# EAGLE design tritiled22_cr2354 (EAGLE 8.2.2)
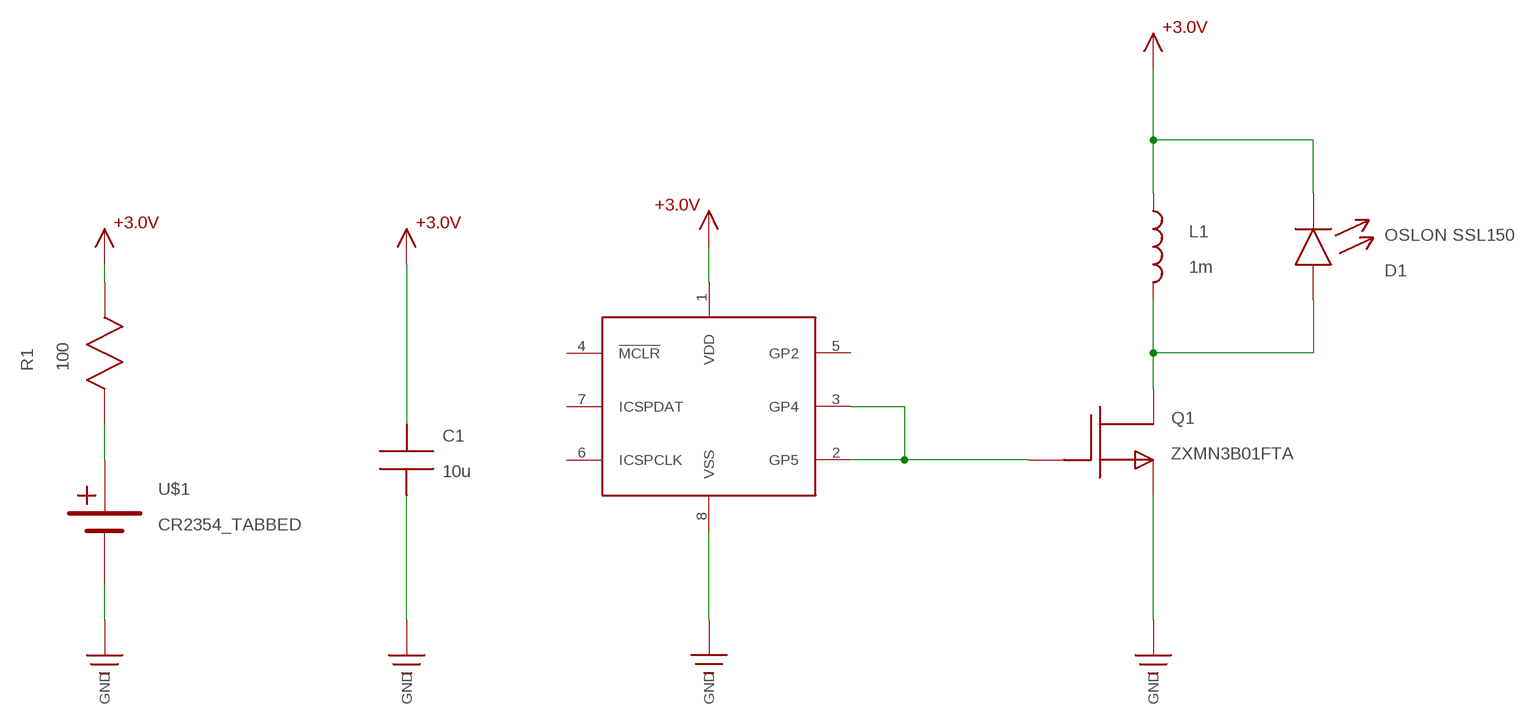
[diagram p0: schematic, sheet 1]

## Parts
C1  10u  C1206  [1206]
D1  OSLON SSL150  LEDSSL150  [OSLON_3030_LED]
L1  1m  SRR6028_INDUCTOR  [SRR6028_INDUCTOR]
Q1  ZXMN3B01FTA  ZXMN3B01FSOT23  [SOT-23]
R1  100  R1206  [R1206]
U1  PIC12LF1571  [SOIC8]
U$1  CR2354_TABBED  [CR2354_TABBED]

## Nets
+3.3V: C1.P$1 D1.C L1.P$1 R1.P$2 U1.1(VDD) ; supply symbol labelled +3.0V
GND: C1.P$2 Q1.2(S) U1.8(VSS) U$1.GND(0V)
N$5: D1.A L1.P$2 Q1.3(D)
N$8: Q1.1(G) U1.2(GP5) U1.3(GP4)
VBATT: R1.P$1 U$1.+3V(+V)
Unconnected: U1.4(!MCLR!) U1.5(GP2) U1.6(ICSPCLK) U1.7(ICSPDAT)

## Library data of the parts
C1 = tritiled:C
D1 = tritiled:LED
L1 = tritiled:SRR6028_INDUCTOR
Q1 = tritiled:ZXMN3B01F
R1 = tritiled:R
U1 = tritiled:PIC12LF1571
U$1 = tritiled:CR2354_TABBED

## Board
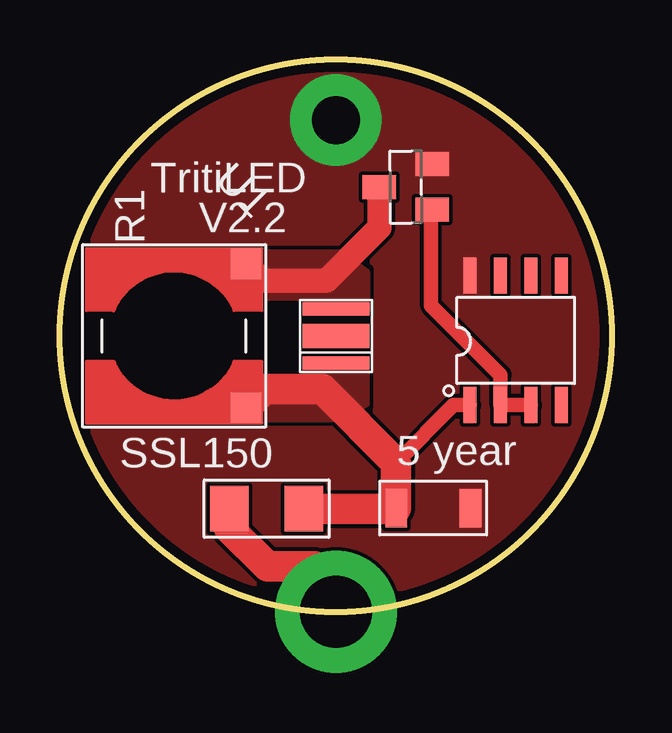
[diagram p1: board, top side]
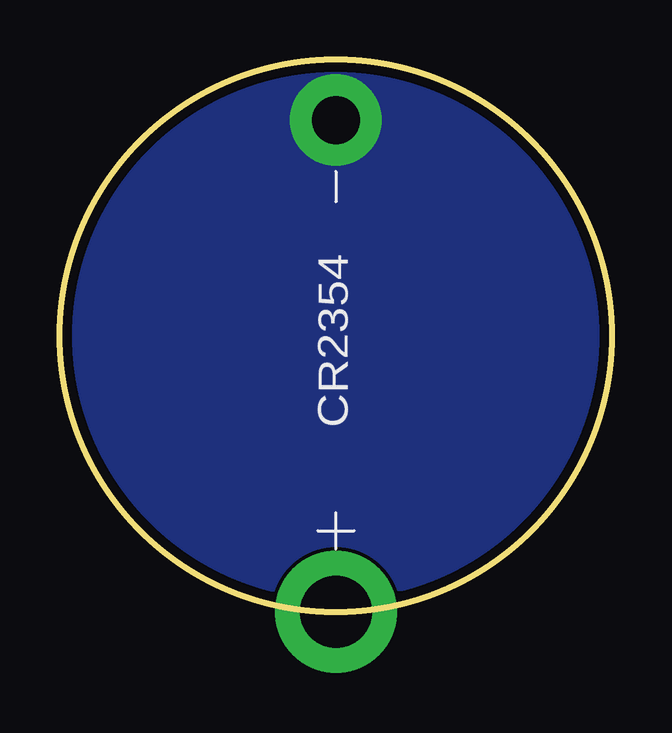
[diagram p2: board, bottom side, seen from below]

Size 23.01 x 23.01 mm. Coordinates in mm from the lower left corner, seen from the top.
Outline: circle at 11.51,11.51 radius 11.51
Copper layers (1*16): Top 0.0356mm / dielectric 1.5011mm / Bottom 0.0356mm
Design rules "LaenPCBOrder_tented_vias": minimum track width 6mil, minimum drill 13mil, track to track 6mil, track to pad 6mil, pad to pad 6mil, via to via 6mil, smd to smd 6mil, copper to edge 15mil, drill to drill 6mil, minimum pad ring 7mil, minimum via ring 7mil, stop-mask expansion 3mil, vias tented up to drill 16mil, thermal gap 10mil

### Footprints (pad centres in the part's own frame; a part is rotated, then mirrored left to right if it is on the bottom)
1206 = smd 0.9 x 1.6: P$1 -1.55,0; P$2 1.55,0
OSLON_3030_LED = smd 0.55 x 2.8: A -1.125,0; C 1.125,0 | smd 1 x 2.8: HS 0,0
SRR6028_INDUCTOR = smd 1.27 x 1.27: P$1 -3,3; P$2 -3,-3
SOT-23 = smd 1 x 1.4: 1 -0.95,-1.1; 2 0.95,-1.1; 3 0,1.1
R1206 = smd 1.6 x 1.9: P$1 -1.55,0; P$2 1.55,0
SOIC8 = smd 0.55 x 1.5: 1 -1.905,-2.7; 2 -0.635,-2.7; 3 0.635,-2.7; 4 1.905,-2.7; 5 1.905,2.7; 6 0.635,2.7; 7 -0.635,2.7; 8 -1.905,2.7
CR2354_TABBED = drill 3 pad 5.08: +3V 0,-11.5 | drill 2 pad 3.81: GND 0,9

### Placement (x,y rotation side)
C1  15.56,4.33 0 top
D1  11.51,11.51 270 top
L1  4.76,11.51 180 top
Q1  14.41,17.72 90 top
R1  8.61,4.3 0 top
U1  19,11.32 0 top
U$1  11.51,11.51 0 bottom

### Tracks (layer width: path | path; a pad name or v marks a point on that pad's centre or on a via)
+3.3V
  Top 0.61: U1.1 16.42,8.62 14.01,6.22
  Top 1.27: R1.P$2 13.99,4.3 C1.P$1 14.01,6.22 10.95,9.28 8.54,9.28 L1.P$1
  pour Top (no thermals): 10.25,10.48 12.79,10.48 12.79,8.66 11.83,8.01 6.11,8.01 7.3,9.6 10.24,9.6 10.25,9.61
GND
  pour Bottom (no thermals): -3.1,-3.1 26.75,-3.1 26.75,26.11 -3.1,26.11
  pour Top (rank 2, no thermals): -3.1,-3.1 26.75,-3.1 26.75,26.11 -3.1,26.11
N$5
  Top 1.016: Q1.3 13.31,16.01 11.11,13.81 8.46,13.81 L1.P$2
  pour Top (no thermals): 6.11,15 11.67,15 12.79,14.19 12.79,12.53 10.25,12.53 10.25,13.09 7.3,13.09
N$8
  Top 0.61: U1.3 U1.2 18.37,9.88 15.48,12.78 15.48,16.73 Q1.1
VBATT
  Top 1.27: U$1.+3V 11.51,1.11 11.11,1.51 11.03,1.51 10.63,1.9 8.65,1.9 7.06,3.49 R1.P$1

### Text on the board
tPlace: TritiLED | V2.2 | SSL150 | 5 year